# Altium schematic sheet Smart_AC_Monitor.SchDoc: Smart AC Monitor
size A3; Author: Lachlan Marshall; Revision: 0; SheetNumber: 1; SheetTotal: 1
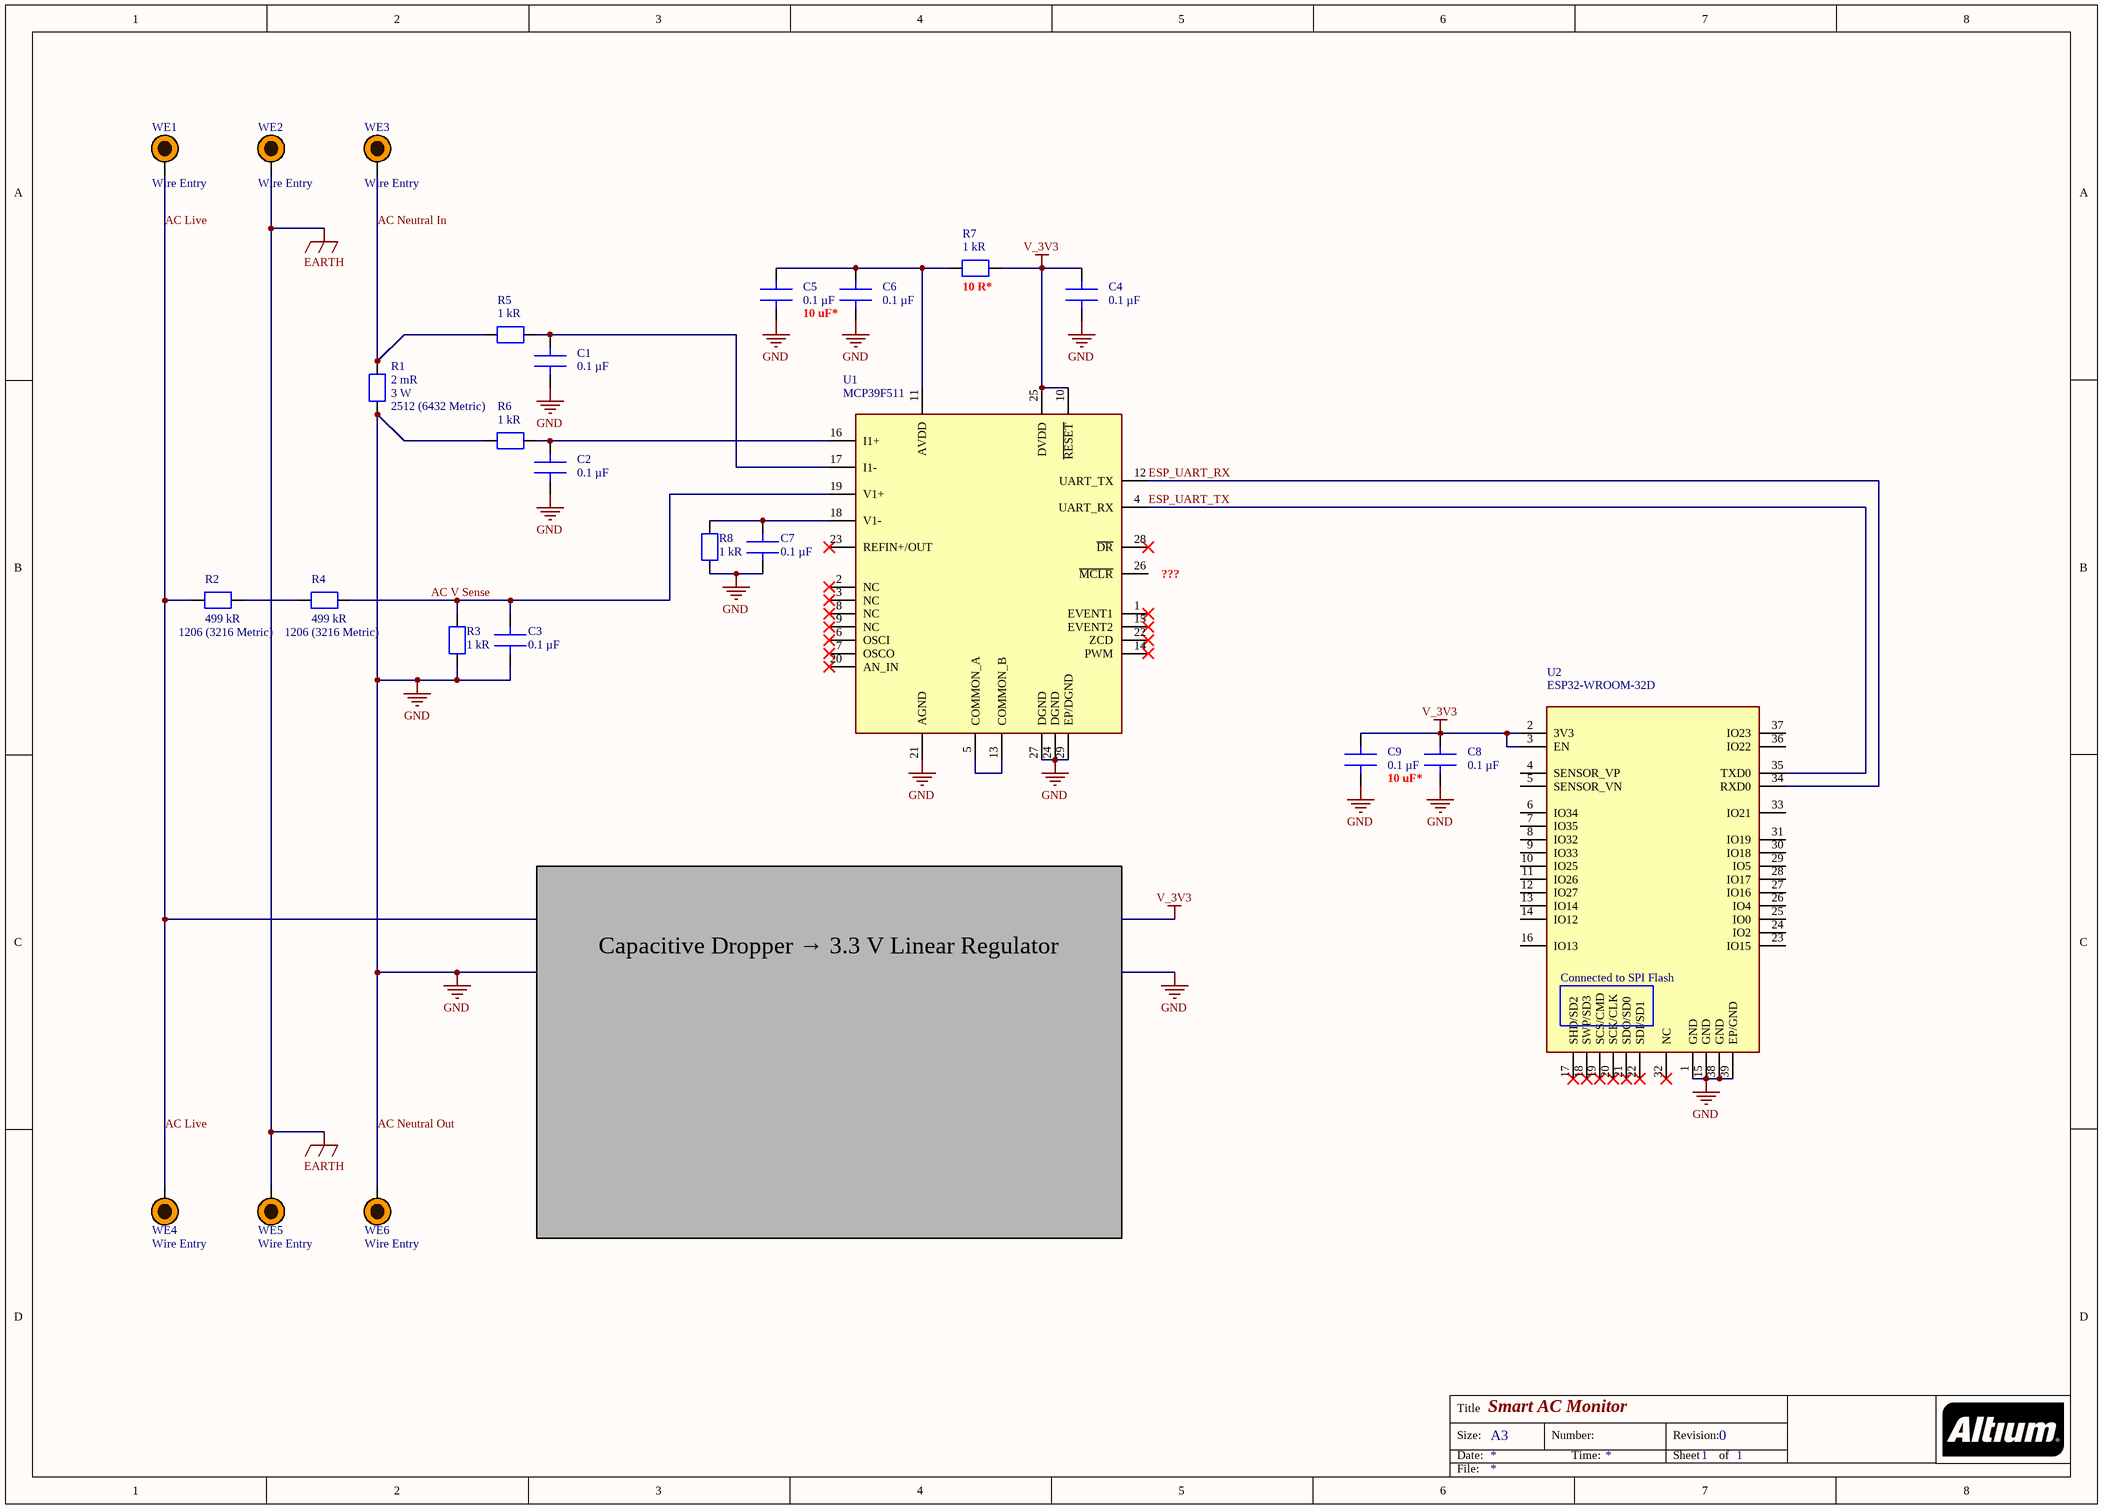
[diagram p0: Smart_AC_Monitor.SchDoc]

## Parts
C1  Capacitance: 0.1 µF  [0805]  (hidden comment: Capacitor)
C2  Capacitance: 0.1 µF  [0805]  (hidden comment: Capacitor)
C3  Capacitance: 0.1 µF  [0805]  (hidden comment: Capacitor)
C4  Capacitance: 0.1 µF  [0805]  (hidden comment: Capacitor)
C5  Capacitance: 0.1 µF  [0805]  (hidden comment: Capacitor)
C6  Capacitance: 0.1 µF  [0805]  (hidden comment: Capacitor)
C7  Capacitance: 0.1 µF  [0805]  (hidden comment: Capacitor)
C8  Capacitance: 0.1 µF  [0805]  (hidden comment: Capacitor)
C9  Capacitance: 0.1 µF  [0805]  (hidden comment: Capacitor)
R1  Resistance: 2 mR  Power: 3 W  Package: 2512 (6432 Metric)  [2512]  (hidden comment: Resistor)
R2  Resistance: 499 kR  Package: 1206 (3216 Metric)  [1206]  (hidden comment: Resistor)
R3  Resistance: 1 kR  [0805]  (hidden comment: Resistor)
R4  Resistance: 499 kR  Package: 1206 (3216 Metric)  [1206]  (hidden comment: Resistor)
R5  Resistance: 1 kR  [0805]  (hidden comment: Resistor)
R6  Resistance: 1 kR  [0805]  (hidden comment: Resistor)
R7  Resistance: 1 kR  [0805]  (hidden comment: Resistor)
R8  Resistance: 1 kR  [0805]  (hidden comment: Resistor)
U1  MCP39F511  [MCP39F511]
U2  ESP32-WROOM-32D  [ESP32-WROOM-32D]
WE1  Wire Entry  [12AWGWireEntry]
WE2  Wire Entry  [12AWGWireEntry]
WE3  Wire Entry  [12AWGWireEntry]
WE4  Wire Entry  [12AWGWireEntry]
WE5  Wire Entry  [12AWGWireEntry]
WE6  Wire Entry  [12AWGWireEntry]

## Nets
AC Neutral Out: C1.2 C2.2 C3.2 C4.2 C5.2 C6.2 C7.2 C8.2 C9.2 R1.2 R3.2 R6.1 R8.1 U1.21(AGND) U1.24(DGND) U1.27(DGND) U1.29(EP/DGND) U2.1(GND) U2.15(GND) U2.38(GND) U2.39(EP/GND) WE6.1  [also labelled GND]
EARTH: WE2.1 WE5.1
V_3V3: C4.1 C8.1 C9.1 R7.2 U1.10(~{RESET}) U1.25(DVDD) U2.2(3V3) U2.3(EN)
AC Live: R2.1 WE1.1 WE4.1
AC Neutral In: R1.1 R5.1 WE3.1
AC V Sense: C3.1 R3.1 R4.2 U1.19(V1+)
ESP_UART_RX: U1.12(UART_TX) U2.34(RXD0)
ESP_UART_TX: U1.4(UART_RX) U2.35(TXD0)
NetC1_1: C1.1 R5.2 U1.17(I1-)
NetC2_1: C2.1 R6.2 U1.16(I1+)
NetC5_1: C5.1 C6.1 R7.1 U1.11(AVDD)
NetC7_1: C7.1 R8.2 U1.18(V1-)
NetR2_2: R2.2 R4.1
NetU1_5: U1.5(COMMON_A) U1.13(COMMON_B)

Not connected (* = marked no-connect by the designer): U1 1(EVENT1)* 2(NC)* 3(NC)* 6(OSCI)* 7(OSCO)* 8(NC)* 9(NC)* 14(PWM)* 15(EVENT2)* 20(AN_IN)* 22(ZCD)* 23(REFIN+/OUT)* 26(~{MCLR}) 28(~{DR})*; U2 4(SENSOR_VP) 5(SENSOR_VN) 6(IO34) 7(IO35) 8(IO32) 9(IO33) 10(IO25) 11(IO26) 12(IO27) 13(IO14) 14(IO12) 16(IO13) 17(SHD/SD2)* 18(SWP/SD3)* 19(SCS/CMD)* 20(SCK/CLK)* 21(SDO/SD0)* 22(SDI/SD1)* 23(IO15) 24(IO2) 25(IO0) 26(IO4) 27(IO16) 28(IO17) 29(IO5) 30(IO18) 31(IO19) 32(NC)* 33(IO21) 36(IO22) 37(IO23)

## Notes on the sheet
- 10 uF*
- (near R7) 10 R*
- (near U1) ???
- Capacitive Dropper → 3.3 V Linear Regulator
- Title
- Size:
- Date:
- A3
- Number:
- Time:
- Revision:
- Sheet
- of
- File:
- (in symbol ESP32-WROOM-32D) Connected to SPI Flash

## Library data of the parts
C1-C9 = Capacitor: AVX Corporation 08055D104KAT2A; Unique Part Number: LM_CAP_0001; Type (Ceramic, Aluminium, etc#): Ceramic X5R; Voltage: 50 V; Tolerance: ±10%; Manufacturer Part Number: AVX Corporation 08055D104KAT2A; Digikey Part Number: 478-12790-1-ND; Package: 0805 (2012 Metric)
R1 = 2 mR 2512 (6432 Metric) Chip: Unique Part Number: LM_RES_0002; Manufacturer Part Number: Riedon CSRL3-0R002F8; Type (Chip, Axial, etc#): Chip; Tolerance: 0.01; Digikey Part Number: 696-1836-1-ND
R2 R4 = 499 kR 1206 (3216 Metric) Chip: Unique Part Number: LM_RES_0003; Manufacturer Part Number: Stackpole Electronics Inc RMCF1206FT499K; Type (Chip, Axial, etc#): Chip; Power: 0.25 W; Tolerance: 0.01; Digikey Part Number: RMCF1206FT499KCT-ND
R3 R5-R8 = 1 kR 0805 (2012 Metric) Chip: Unique Part Number: LM_RES_0001; Manufacturer Part Number: Stackpole Electronics Inc RMCF0805FT1K00; Type (Chip, Axial, etc#): Chip; Power: 0.125 W; Tolerance: 0.01; Digikey Part Number: RMCF0805FT1K00CT-ND; Package: 0805 (2012 Metric)
U1 = MCP39F511: Single Phase Meter IC 28-QFN (5x5); Unique Part Number: LM_IC_0001; Manufacturer Part Number: Microchip Technology MCP39F511-E/MQ; Digikey Part Number: MCP39F511-E/MQ-ND; Package: 28-QFN (5x5); Temperature Range: -40°C ~ 125°C
U2 = ESP32-WROOM-32D: Bluetooth, WiFi,3 Transceiver Module; Unique Part Number: LM_IC_0002; Manufacturer Part Number: Espressif Systems ESP32-WROOM-32D; Digikey Part Number: 1904-1023-1-ND; Package: 38-SMD Module; Temperature Range: -40°C ~ 85°C
WE1-WE6 = Wire Entry: 12 AWG Wire Entry; Unique Part Number: LM_OTH_0001